# EAGLE schematic bmsf3 (EAGLE 4.13)
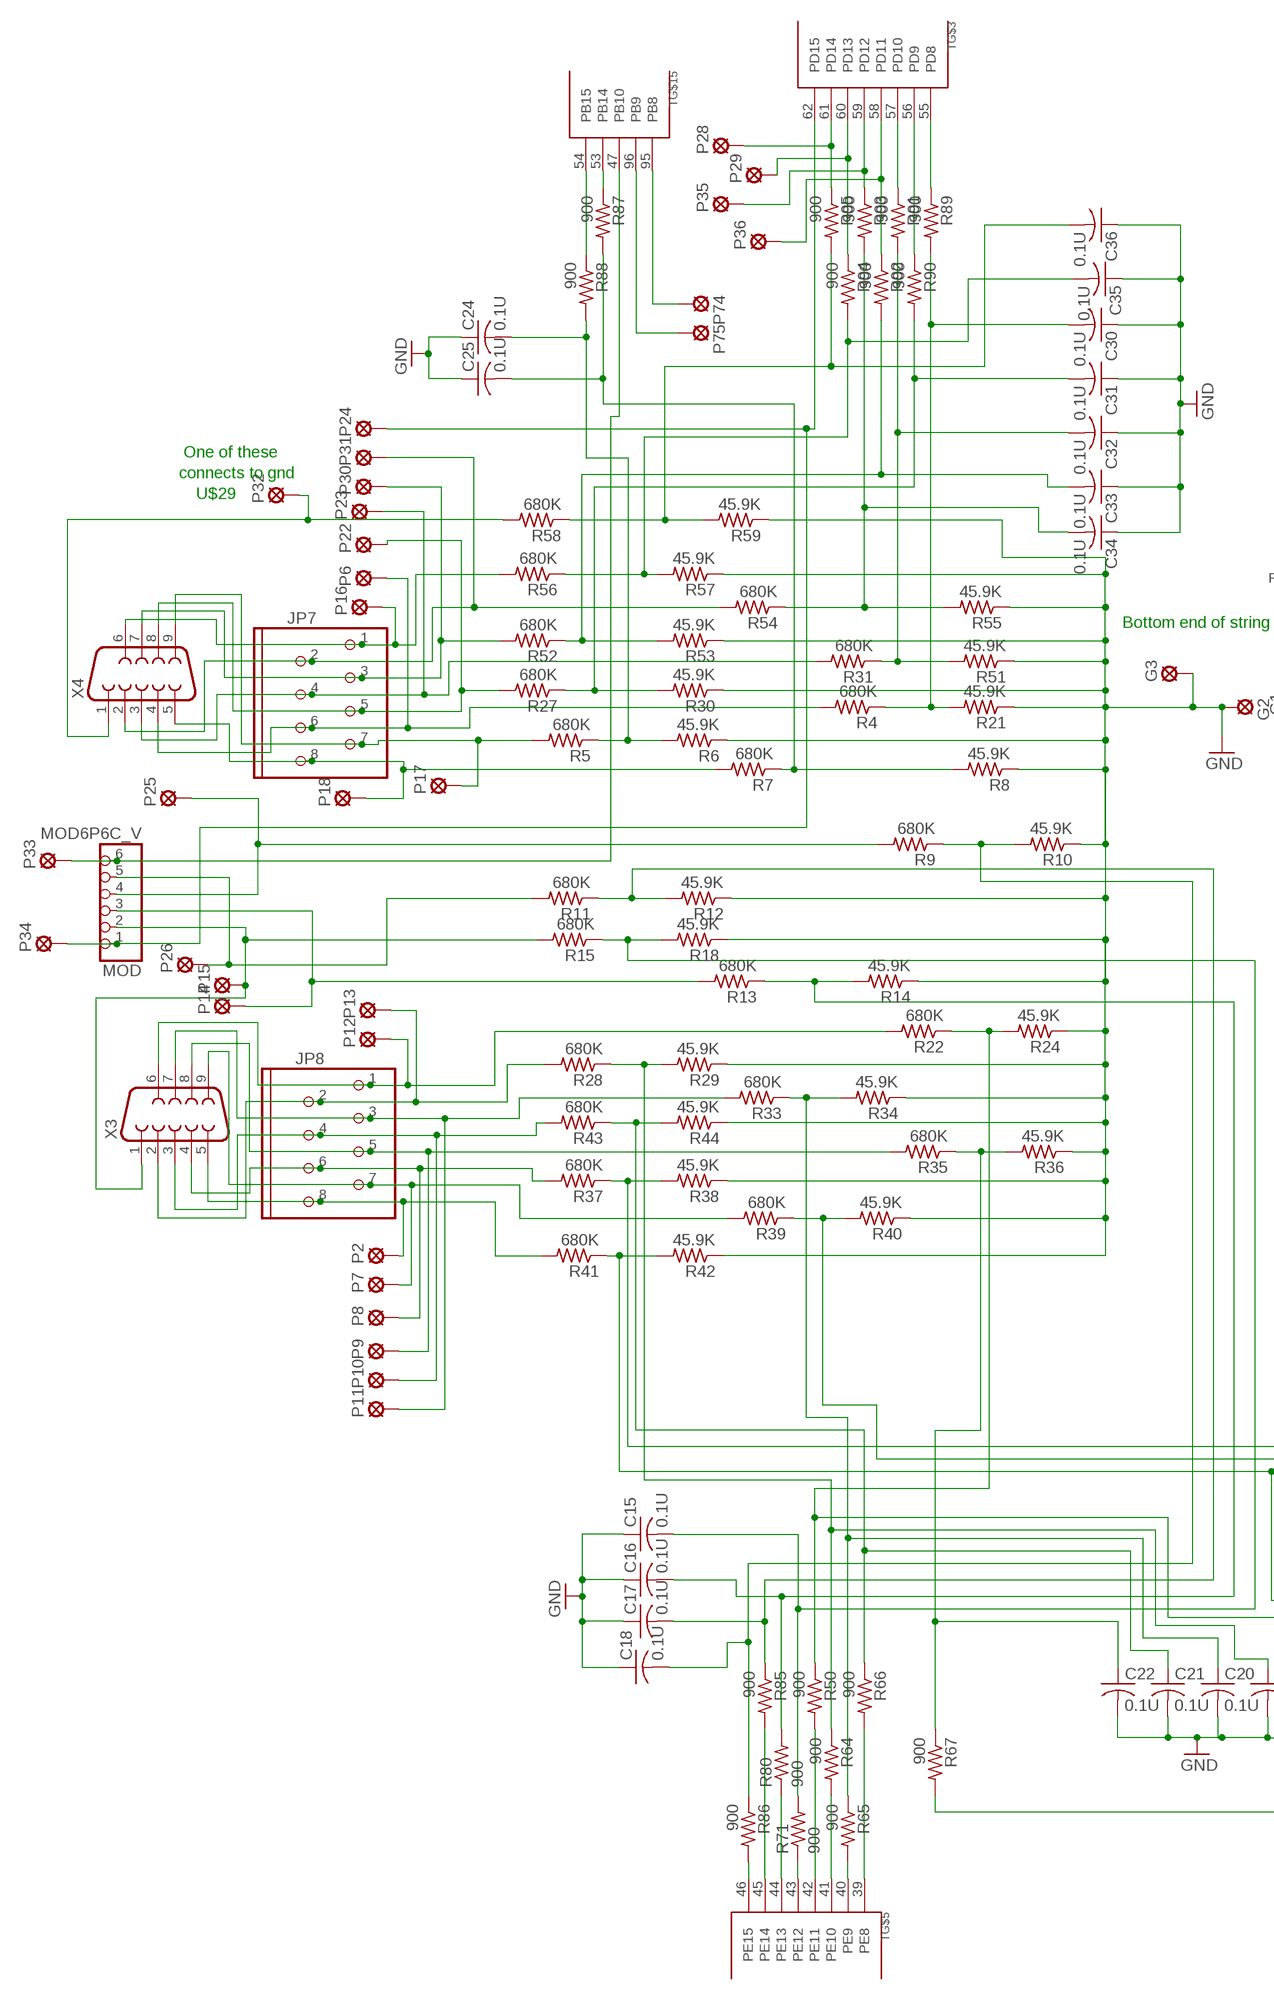
[diagram p0: schematic, sheet 1, part 1 of 2]
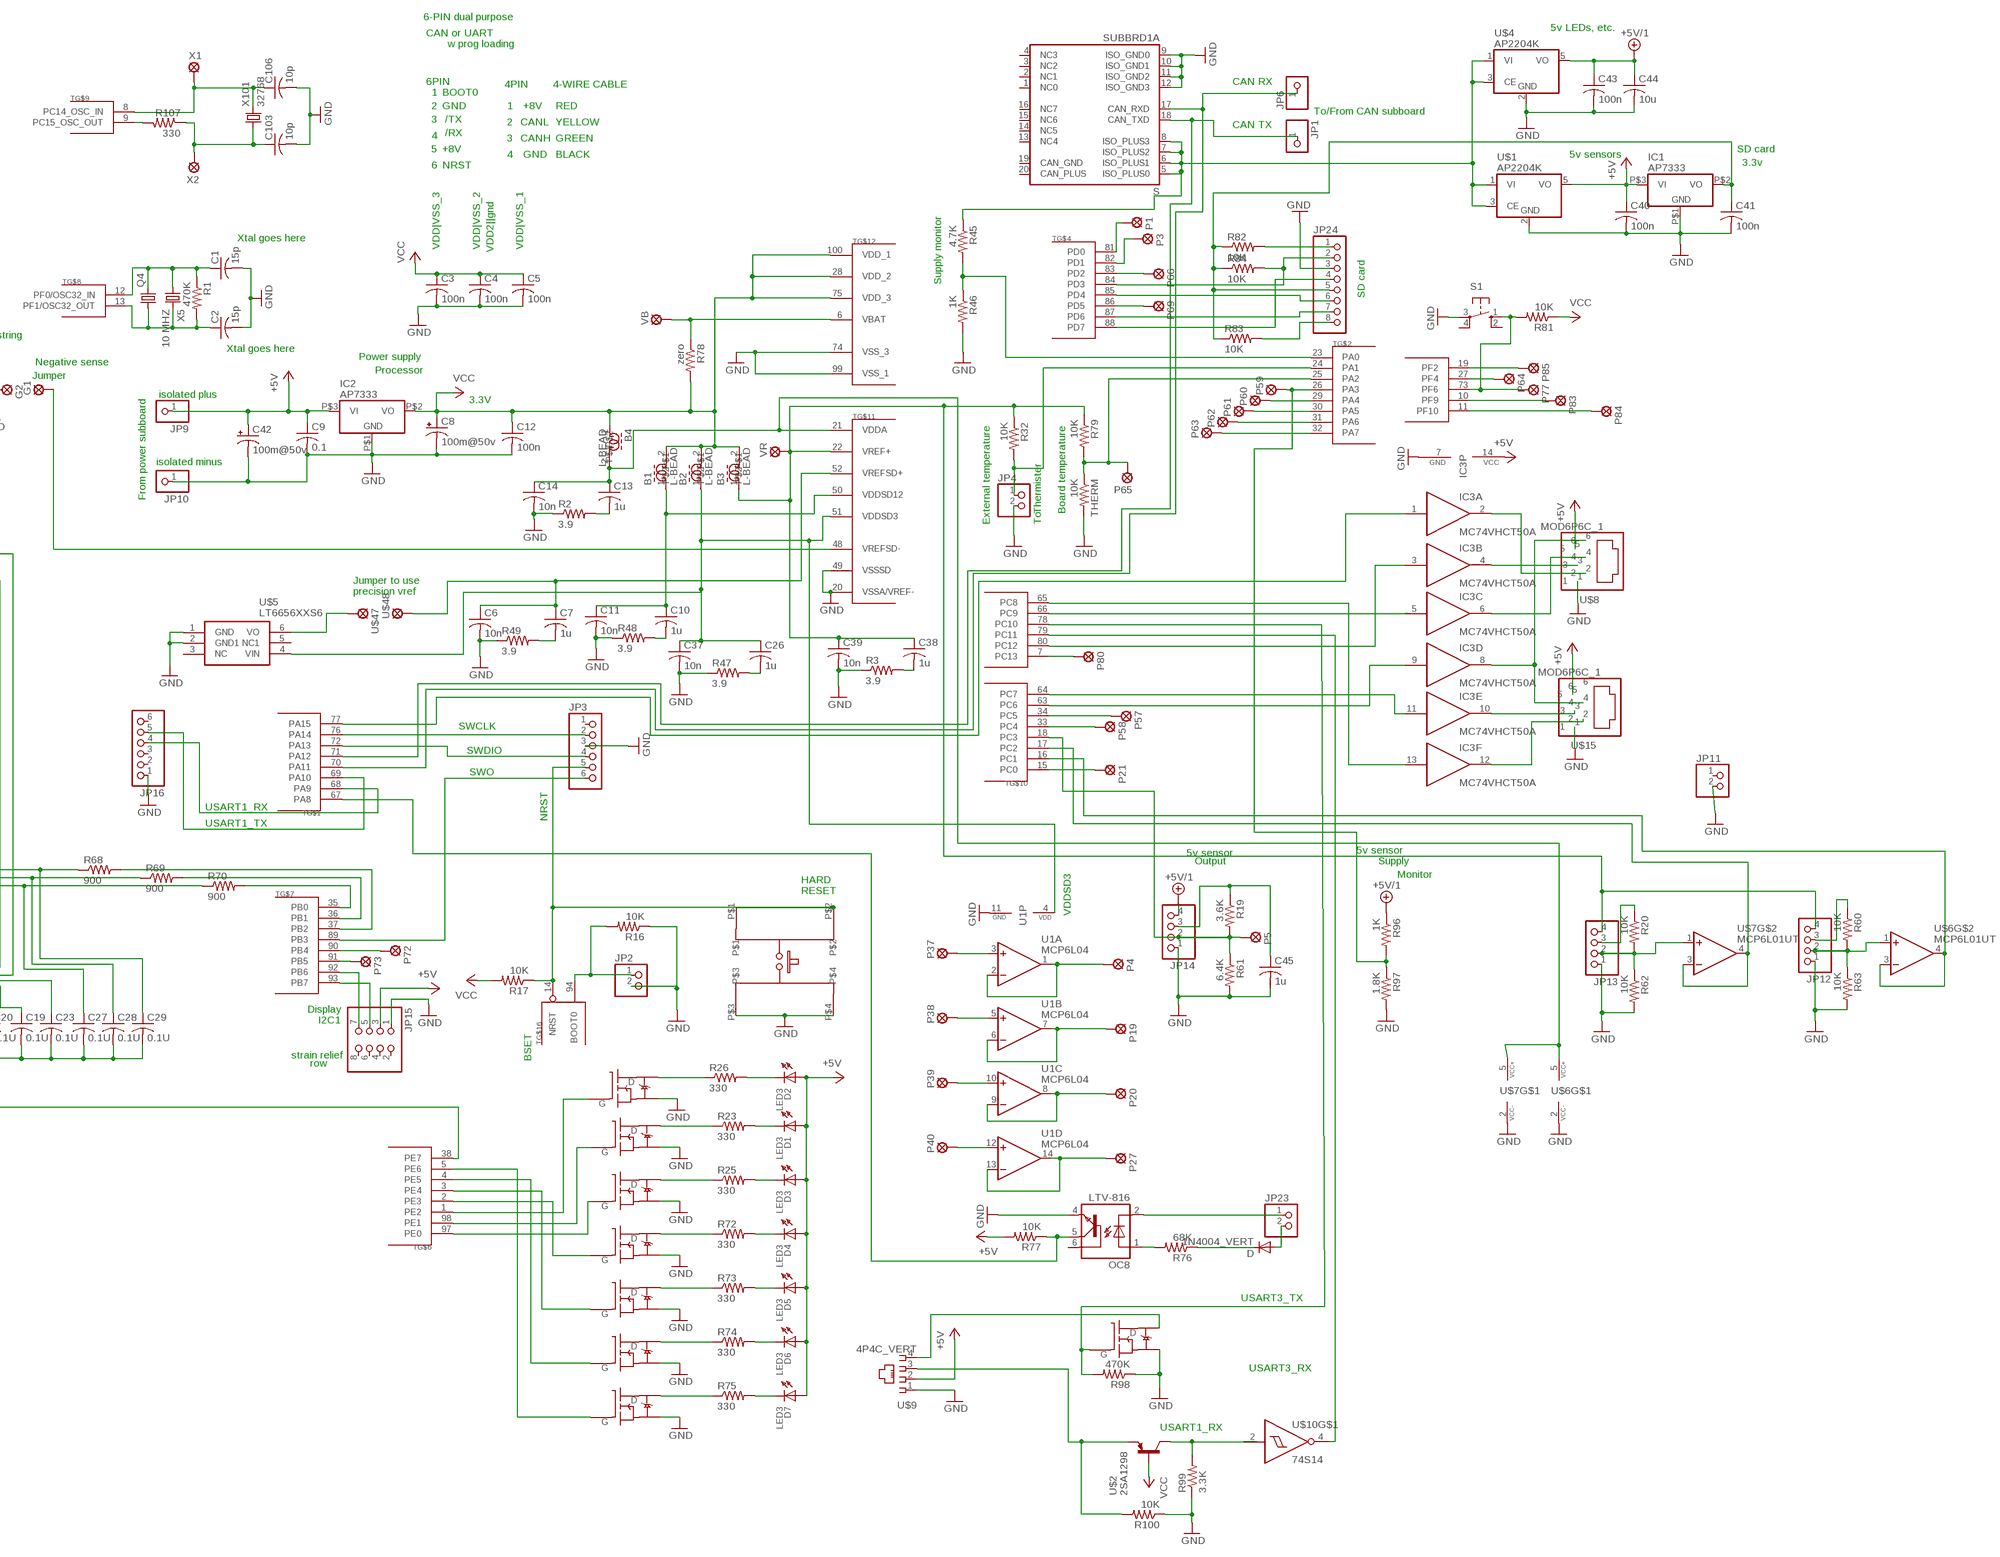
[diagram p1: schematic, sheet 1, part 2 of 2]

## Parts
B1  L-BEAD  [C0805]
B2  L-BEAD  [C0805]
B3  L-BEAD  [C0805]
B4  L-BEAD  [C0805]
C1  15p  C-USC0603  [C0603]
C2  15p  C-USC0603  [C0603]
C3  100n  C-USC0603  [C0603]
C4  100n  C-USC0603  [C0603]
C5  100n  C-USC0603  [C0603]
C6  10n  C-USC0603  [C0603]
C7  1u  C-USC0603  [C0603]
C8  100m@50v  CPOL-USE5-8.5  [E5-8,5]
C9  0.1  C-USC0603  [C0603]
C10  1u  C-USC0603  [C0603]
C11  10n  C-USC0603  [C0603]
C12  100n  C-USC0603  [C0603]
C13  1u  C-USC0603  [C0603]
C14  10n  C-USC0603  [C0603]
C15  0.1U  C-USC0603  [C0603]
C16  0.1U  C-USC0603  [C0603]
C17  0.1U  C-USC0603  [C0603]
C18  0.1U  C-USC0603  [C0603]
C19  0.1U  C-USC0603  [C0603]
C20  0.1U  C-USC0603  [C0603]
C21  0.1U  C-USC0603  [C0603]
C22  0.1U  C-USC0603  [C0603]
C23  0.1U  C-USC0603  [C0603]
C24  0.1U  C-USC0603  [C0603]
C25  0.1U  C-USC0603  [C0603]
C26  1u  C-USC0603  [C0603]
C27  0.1U  C-USC0603  [C0603]
C28  0.1U  C-USC0603  [C0603]
C29  0.1U  C-USC0603  [C0603]
C30  0.1U  C-USC0603  [C0603]
C31  0.1U  C-USC0603  [C0603]
C32  0.1U  C-USC0603  [C0603]
C33  0.1U  C-USC0603  [C0603]
C34  0.1U  C-USC0603  [C0603]
C35  0.1U  C-USC0603  [C0603]
C36  0.1U  C-USC0603  [C0603]
C37  10n  C-USC0603  [C0603]
C38  1u  C-USC0603  [C0603]
C39  10n  C-USC0603  [C0603]
C40  100n  C-USC0603  [C0603]
C41  100n  C-USC0603  [C0603]
C42  100m@50v  CPOL-USE5-8.5  [E5-8,5]
C43  100n  C-USC0603  [C0603]
C44  10u  C-USC0603  [C0603]
C45  1u  C-USC0603  [C0603]
C103  10p  C-USC0603  [C0603]
C106  10p  C-USC0603  [C0603]
D  1N4004_VERT  [DO41-10_VERT]
D1  LED3  [LED3]
D2  LED3  [LED3]
D3  LED3  [LED3]
D4  LED3  [LED3]
D5  LED3  [LED3]
D6  LED3  [LED3]
D7  LED3  [LED3]
G1  SOLDPAD028  [SOLPAD028]
G2  SOLDPAD028  [SOLPAD028]
G3  SOLDPAD028  [SOLPAD028]
IC1  AP7333  MCP1702  [SOT-23A]
IC2  AP7333  MCP1702  [SOT-23A]
IC3  MC74VHCT50A  7407  [TSSOP14]
JP1  PINHD-1X1  [1X01]
JP2  PINHD-1X2  [1X02]
JP3  PINHD-1X6  [1X06]
JP4  PINHD-1X2  [1X02]
JP6  PINHD-1X1  [1X01]
JP7  MOD8P8C  [MOD8P8C]
JP8  MOD8P8C  [MOD8P8C]
JP9  PINHD-1X1  [1X01]
JP10  PINHD-1X1  [1X01]
JP11  PINHD-1X2  [1X02]
JP12  PINHD-1X4  [1X04]
JP13  PINHD-1X4  [1X04]
JP14  PINHD-1X4  [1X04]
JP15  PINHD-2X4  [2X04]
JP16  PINHD-1X6  [1X06]
JP23  PINHD-1X2  [1X02]
JP24  PINHD-1X8  [1X08]
MOD  MOD6P6C_V  [MOD6P6C_VERT]
OC8  LTV-816  4N35  [DIL06]
P1  SOLDPAD028  [SOLPAD028]
P2  SOLDPAD028  [SOLPAD028]
P3  SOLDPAD028  [SOLPAD028]
P4  SOLDPAD028  [SOLPAD028]
P5  SOLDPAD028  [SOLPAD028]
P6  SOLDPAD028  [SOLPAD028]
P7  SOLDPAD028  [SOLPAD028]
P8  SOLDPAD028  [SOLPAD028]
P9  SOLDPAD028  [SOLPAD028]
P10  SOLDPAD028  [SOLPAD028]
P11  SOLDPAD028  [SOLPAD028]
P12  SOLDPAD028  [SOLPAD028]
P13  SOLDPAD028  [SOLPAD028]
P14  SOLDPAD028  [SOLPAD028]
P15  SOLDPAD028  [SOLPAD028]
P16  SOLDPAD028  [SOLPAD028]
P17  SOLDPAD028  [SOLPAD028]
P18  SOLDPAD028  [SOLPAD028]
P19  SOLDPAD028  [SOLPAD028]
P20  SOLDPAD028  [SOLPAD028]
P21  SOLDPAD028  [SOLPAD028]
P22  SOLDPAD028  [SOLPAD028]
P23  SOLDPAD028  [SOLPAD028]
P24  SOLDPAD028  [SOLPAD028]
P25  SOLDPAD028  [SOLPAD028]
P26  SOLDPAD028  [SOLPAD028]
P27  SOLDPAD028  [SOLPAD028]
P28  SOLDPAD028  [SOLPAD028]
P29  SOLDPAD028  [SOLPAD028]
P30  SOLDPAD028  [SOLPAD028]
P31  SOLDPAD028  [SOLPAD028]
P32  SOLDPAD028  [SOLPAD028]
P33  SOLDPAD028  [SOLPAD028]
P34  SOLDPAD028  [SOLPAD028]
P35  SOLDPAD028  [SOLPAD028]
P36  SOLDPAD028  [SOLPAD028]
P37  SOLDPAD028  [SOLPAD028]
P38  SOLDPAD028  [SOLPAD028]
P39  SOLDPAD028  [SOLPAD028]
P40  SOLDPAD028  [SOLPAD028]
P57  SOLDPAD028  [SOLPAD028]
P58  SOLDPAD028  [SOLPAD028]
P59  SOLDPAD028  [SOLPAD028]
P60  SOLDPAD028  [SOLPAD028]
P61  SOLDPAD028  [SOLPAD028]
P62  SOLDPAD028  [SOLPAD028]
P63  SOLDPAD028  [SOLPAD028]
P64  SOLDPAD028  [SOLPAD028]
P65  SOLDPAD028  [SOLPAD028]
P66  SOLDPAD028  [SOLPAD028]
P69  SOLDPAD028  [SOLPAD028]
P72  SOLDPAD028  [SOLPAD028]
P73  SOLDPAD028  [SOLPAD028]
P74  SOLDPAD028  [SOLPAD028]
P75  SOLDPAD028  [SOLPAD028]
P77  SOLDPAD028  [SOLPAD028]
P80  SOLDPAD028  [SOLPAD028]
P83  SOLDPAD028  [SOLPAD028]
P84  SOLDPAD028  [SOLPAD028]
P85  SOLDPAD028  [SOLPAD028]
Q1  IRLML2060  [SOT-23]
Q2  IRLML2060  [SOT-23]
Q3  IRLML2060  [SOT-23]
Q4  CRYTALHC49U-V  [HC49U-V]
Q6  IRLML2060  [SOT-23]
Q12  IRLML2060  [SOT-23]
Q13  IRLML2060  [SOT-23]
Q14  IRLML2060  [SOT-23]
Q15  IRLML2060  [SOT-23]
R1  470K  R-US_R0603  [R0603]
R2  3.9  R-US_R0603  [R0603]
R3  3.9  R-US_R0603  [R0603]
R4  680K  R-US_R0603  [R0603]
R5  680K  R-US_R0603  [R0603]
R6  45.9K  R-US_R0603  [R0603]
R7  680K  R-US_R0603  [R0603]
R8  45.9K  R-US_R0603  [R0603]
R9  680K  R-US_R0603  [R0603]
R10  45.9K  R-US_R0603  [R0603]
R11  680K  R-US_R0603  [R0603]
R12  45.9K  R-US_R0603  [R0603]
R13  680K  R-US_R0603  [R0603]
R14  45.9K  R-US_R0603  [R0603]
R15  680K  R-US_R0603  [R0603]
R16  10K  R-US_R0603  [R0603]
R17  10K  R-US_R0603  [R0603]
R18  45.9K  R-US_R0603  [R0603]
R19  3.6K  R-US_R0603  [R0603]
R20  10K  R-US_R0603  [R0603]
R21  45.9K  R-US_R0603  [R0603]
R22  680K  R-US_R0603  [R0603]
R23  330  R-US_R0603  [R0603]
R24  45.9K  R-US_R0603  [R0603]
R25  330  R-US_R0603  [R0603]
R26  330  R-US_R0603  [R0603]
R27  680K  R-US_R0603  [R0603]
R28  680K  R-US_R0603  [R0603]
R29  45.9K  R-US_R0603  [R0603]
R30  45.9K  R-US_R0603  [R0603]
R31  680K  R-US_R0603  [R0603]
R32  10K  R-US_R0603  [R0603]
R33  680K  R-US_R0603  [R0603]
R34  45.9K  R-US_R0603  [R0603]
R35  680K  R-US_R0603  [R0603]
R36  45.9K  R-US_R0603  [R0603]
R37  680K  R-US_R0603  [R0603]
R38  45.9K  R-US_R0603  [R0603]
R39  680K  R-US_R0603  [R0603]
R40  45.9K  R-US_R0603  [R0603]
R41  680K  R-US_R0603  [R0603]
R42  45.9K  R-US_R0603  [R0603]
R43  680K  R-US_R0603  [R0603]
R44  45.9K  R-US_R0603  [R0603]
R45  4.7K  R-US_R0603  [R0603]
R46  1K  R-US_R0603  [R0603]
R47  3.9  R-US_R0603  [R0603]
R48  3.9  R-US_R0603  [R0603]
R49  3.9  R-US_R0603  [R0603]
R50  900  R-US_R0603  [R0603]
R51  45.9K  R-US_R0603  [R0603]
R52  680K  R-US_R0603  [R0603]
R53  45.9K  R-US_R0603  [R0603]
R54  680K  R-US_R0603  [R0603]
R55  45.9K  R-US_R0603  [R0603]
R56  680K  R-US_R0603  [R0603]
R57  45.9K  R-US_R0603  [R0603]
R58  680K  R-US_R0603  [R0603]
R59  45.9K  R-US_R0603  [R0603]
R60  10K  R-US_R0603  [R0603]
R61  6.4K  R-US_R0603  [R0603]
R62  10K  R-US_R0603  [R0603]
R63  10K  R-US_R0603  [R0603]
R64  900  R-US_R0603  [R0603]
R65  900  R-US_R0603  [R0603]
R66  900  R-US_R0603  [R0603]
R67  900  R-US_R0603  [R0603]
R68  900  R-US_R0603  [R0603]
R69  900  R-US_R0603  [R0603]
R70  900  R-US_R0603  [R0603]
R71  900  R-US_R0603  [R0603]
R72  330  R-US_R0603  [R0603]
R73  330  R-US_R0603  [R0603]
R74  330  R-US_R0603  [R0603]
R75  330  R-US_R0603  [R0603]
R76  68K  R-US_R0603  [R0603]
R77  10K  R-US_R0603  [R0603]
R78  zero  R-US_R0603  [R0603]
R79  10K  R-US_R0603  [R0603]
R80  900  R-US_R0603  [R0603]
R81  10K  R-US_R0603  [R0603]
R82  10K  R-US_R0603  [R0603]
R83  10K  R-US_R0603  [R0603]
R84  10K  R-US_R0603  [R0603]
R85  900  R-US_R0603  [R0603]
R86  900  R-US_R0603  [R0603]
R87  900  R-US_R0603  [R0603]
R88  900  R-US_R0603  [R0603]
R89  900  R-US_R0603  [R0603]
R90  900  R-US_R0603  [R0603]
R91  900  R-US_R0603  [R0603]
R92  900  R-US_R0603  [R0603]
R93  900  R-US_R0603  [R0603]
R94  900  R-US_R0603  [R0603]
R95  900  R-US_R0603  [R0603]
R96  1K  R-US_R0603  [R0603]
R97  1.8K  R-US_R0603  [R0603]
R98  470K  R-US_R0603  [R0603]
R99  3.3K  R-US_R0603  [R0603]
R100  10K  R-US_R0603  [R0603]
R107  330  R-US_M0805  [M0805]
S  SUBBRD1A  [SUBBRD1B]
S1  10-XX  [B3F-10XX]
SW1  E-SWITCH  [E-SWITCH]
T  STM32F373VXT6  [TQFP100_NARROW]
THERM  10K  R-US_R0603  [R0603]
U1  MCP6L04  TLC084T  [TSSOP14]
U$1  AP2204K  [SOT-25]
U$2  2SA1298  [SOT23]
U$4  AP2204K  [SOT-25]
U$5  LT6656XXS6  [SOT23-6]
U$6  MCP6L01UT  [SOT23-5]
U$7  MCP6L01UT  [SOT23-5]
U$8  MOD6P6C_1  [MOD6P6C_1]
U$9  4P4C_VERT  [MOD4P4C_VERT]
U$10  74S14  [SOT-23]
U$15  MOD6P6C_1  [MOD6P6C_1]
U$47  SOLDPAD028  [SOLPAD028]
U$48  SOLDPAD028  [SOLPAD028]
VB  SOLDPAD028  [SOLPAD028]
VR  SOLDPAD028  [SOLPAD028]
X1  SOLDPAD028  [SOLPAD028]
X2  SOLDPAD028  [SOLPAD028]
X3  F09H  [F09H]
X4  F09HP  [F09HP]
X5  10 MHZ  CRYTALHC49UP  [HC49UP]
X101  32768  CRYTAL  [TC26H_SMD]

## Nets
3.3V+SD_POWER: C41.1 IC1.P$2(VO) JP24.5 R82.1 R83.1 R84.1
4WIRE_RCV: R100.2 U$2.2(E) U$9.3
4WIRE_XMIT: Q6.3(D) U$9.4
+5V: C9.1 C40.1 C42.+ D1.A D2.A D3.A D4.A D5.A D6.A D7.A IC1.P$3(VI) IC2.P$3(VI) IC3.14(P:VCC) JP9.1 JP15.3 R77.2 U$1.5(VO) U$8.5 U$9.2 U$15.5
+5V/1: C43.1 C44.1 JP14.4 R96.1 U$4.5(VO)
+7V: R45.1 S.5(ISO_PLUS0) S.6(ISO_PLUS1) S.7(ISO_PLUS2) S.8(ISO_PLUS3) U$1.1(VI) U$1.3(CE) U$4.1(VI) U$4.3(CE)
BOOT0: JP2.1 R16.2 T.94(BOOT0)
GND: C1.2 C2.2 C3.2 C4.2 C5.2 C6.2 C8.- C9.2 C11.2 C12.2 C14.2 C15.1 C16.1 C17.1 C18.1 C19.2 C20.2 C21.2 C22.2 C23.2 C24.1 C25.1 C27.2 C28.2 C29.2 C30.1 C31.1 C32.1 C33.1 C34.1 C35.1 C36.1 C37.2 C39.2 C40.2 C41.2 C42.- C43.2 C44.2 C45.2 C103.2 C106.2 G2.MP G3.MP IC1.P$1(GND) IC2.P$1(GND) IC3.7(P:GND) JP2.2 JP3.3 JP4.2 JP10.1 JP11.2 JP12.1 JP13.1 JP14.1 JP15.1 JP16.1 JP24.3 OC8.4(EMI) Q1.2(S) Q2.2(S) Q3.2(S) Q6.2(S) Q12.2(S) Q13.2(S) Q14.2(S) Q15.2(S) R2.1 R3.1 R6.1 R8.1 R10.1 R12.1 R14.1 R16.1 R18.1 R21.1 R24.1 R29.1 R30.1 R34.1 R36.1 R38.1 R40.1 R42.1 R44.1 R46.2 R47.1 R48.1 R49.1 R51.1 R53.1 R55.1 R57.1 R59.1 R61.2 R62.2 R63.2 R97.2 R98.1 R99.1 R100.1 S1.3(P) S.9(ISO_GND0) S.10(ISO_GND1) S.11(ISO_GND2) S.12(ISO_GND3) SW1.P$3 SW1.P$4 T.20(VSSA/VREF-) T.49(VSSSD) T.74(VSS_3) T.99(VSS_1) THERM.2 U1.11(P:GND) U$1.2(GND) U$4.2(GND) U$5.1(GND) U$5.2(GND1) U$6.2(VCC-) U$7.2(VCC-) U$8.1 U$9.1 U$15.1
LT6656_VO: U$5.6(VO) U$47.MP
N$1: C45.1 JP14.3 R19.1
N$2: D.C R76.1
N$9: P19.MP U1.6(B:-IN) U1.7(B:OUT)
N$10: P27.MP U1.13(D:-IN) U1.14(D:OUT)
N$11: P4.MP U1.1(A:OUT) U1.2(A:-IN)
N$12: JP13.2 R20.2 R62.1 U$7.1(+IN)
N$13: JP12.2 R60.2 R63.1 U$6.1(+IN)
N$16: P20.MP U1.8(C:OUT) U1.9(C:-IN)
N$18: P37.MP U1.3(A:+IN)
N$19: P38.MP U1.5(B:+IN)
N$20: P39.MP U1.10(C:+IN)
N$21: P40.MP U1.12(D:+IN)
N$39: R107.2 T.9(PC15_OSC_OUT)
N$44: OC8.1(A) R76.2
N$46: JP23.1 OC8.2(C)
N$47: D.A JP23.2
N$61: JP13.3 R20.1
N$62: JP12.3 R60.1
NRST: JP3.5 R17.1 SW1.P$1 SW1.P$2 T.14(NRST)
P77: P83.MP T.10(PF9)
PA0|SUPPLY_MONITOR|ADC_0|COMP1_INM: R45.2 R46.1 T.23(PA0)
PA1|THERMISTOR|ADC_1|CPM1_INP: JP4.1 R32.2 T.24(PA1)
PA2|THERMISTOR|ADC_2|COMP2_INM: P65.MP R79.2 T.25(PA2) THERM.1
PA3|ADC_3|COMP2_INP: P59.MP R96.2 R97.1 T.26(PA3)
PA4|SPI1_NSS|SD_CS|ADC_4: P60.MP T.29(PA4)
PA5|SPI1_CK|SD_CLK|ADC_5: P61.MP T.30(PA5)
PA6|SPI1_MISO|SD_DO|ADC_6: P62.MP T.31(PA6)
PA7|SPI1_MOSI|SD_DI|ADC_7: P63.MP T.32(PA7)
PA8: OC8.5(COL) R77.1 T.67(PA8)
PA9_USART1_TX: JP16.5 T.69(PA10)
PA10_USART1_RX: JP16.4 T.68(PA9)
PA11_CANRX: JP6.1 S.17(CAN_RXD) T.70(PA11)
PA12_CANTX: JP1.1 S.18(CAN_TXD) T.71(PA12)
PA13_SWDIO: JP3.4 T.72(PA13)
PA14_SWCLK: JP3.2 T.76(PA14)
PA15: IC3.1(A:I) T.77(PA15)
PA15_BUFF: IC3.2(A:O) U$8.2
PB0: R70.2 T.35(PB0)
PB0|SD1_6P|ADC_8: C27.1 R41.1 R42.2 R70.1
PB1: R69.2 T.36(PB1)
PB1|SD1_5P|SD1_6M|ADC_9: C28.1 R39.1 R40.2 R69.1
PB2: R68.2 T.37(PB2)
PB2|SD1_4P|SD2_6P: C29.1 R37.1 R38.2 R68.1
PB3_SWO: JP3.6 T.89(PB3)
PB4: P72.MP T.90(PB4)
PB5: P73.MP T.91(PB5)
PB6|I2C1_SCL: JP15.7 T.92(PB6)
PB7|I2C1_SDA: JP15.5 T.93(PB7)
PB8: P74.MP T.95(PB8)
PB9: P75.MP T.96(PB9)
PB10|SD2_0P: MOD.6 P33.MP T.47(PB10)
PB14: R87.1 T.53(PB14)
PB15: R88.1 T.54(PB15)
PB15_PWRLED: D2.K R26.2
PB15_PWRLED_D: Q3.3(D) R26.1
PC0: P21.MP T.15(PC0)
PC1|ADC11: T.16(PC1) U$6.3(-IN) U$6.4(OUT)
PC2|ADC12: T.17(PC2) U$7.3(-IN) U$7.4(OUT)
PC3|ADC13: JP14.2 P5.MP R19.2 R61.1 T.18(PC3)
PC4: P58.MP T.33(PC4)
PC4_LED1: D1.K R23.2
PC4_LED_D: Q1.3(D) R23.1
PC5: P57.MP T.34(PC5)
PC5_LED1: D4.K R72.2
PC5_LED2: D3.K R25.2
PC5_LED3: D5.K R73.2
PC5_LED4: D6.K R74.2
PC5_LED5: D7.K R75.2
PC5_LED_D: Q2.3(D) R25.1
PC5_LED_D1: Q12.3(D) R72.1
PC5_LED_D2: Q13.3(D) R73.1
PC5_LED_D3: Q14.3(D) R74.1
PC5_LED_D4: Q15.3(D) R75.1
PC6: IC3.9(D:I) T.63(PC6)
PC6_BUFF: IC3.8(D:O) U$8.6 U$15.4
PC7: IC3.11(E:I) T.64(PC7)
PC7_BUFF: IC3.10(E:O) U$15.3
PC8: IC3.13(F:I) T.65(PC8)
PC8_BUFF: IC3.12(F:O) U$15.2
PC9: IC3.5(C:I) T.66(PC9)
PC9_BUFF: IC3.6(C:O) U$8.4
PC10_USART3_TX: Q6.1(G) R98.2 T.78(PC10)
PC11_USART3_RX: T.79(PC11) U$10.4(O)
PC12: IC3.3(B:I) T.80(PC12)
PC12_BUFF: IC3.4(B:O) U$8.3
PC13: P80.MP T.7(PC13)
PC14_OSC32IN|XTAL: C103.1 R107.1 X2.MP X101.P$1
PC14_OSC_IN: C106.1 T.8(PC14_OSC_IN) X1.MP X101.P$2
PD0: P1.MP T.81(PD0)
PD0_OSC_IN_XTAL: C1.1 Q4.2 R1.1 T.12(PF0/OSC32_IN) X5.1
PD1: P3.MP T.82(PD1)
PD1_OSC_OUT_XTAL: C2.1 Q4.1 R1.2 T.13(PF1/OSC32_OUT) X5.2
PD2: P66.MP T.83(PD2)
PD3|SPI2_MISO: JP24.2 R84.2 T.84(PD3)
PD4|SPI2_MOSI: JP24.6 T.85(PD4)
PD5|USART2_TX: P69.MP T.86(PD5)
PD6|SPI2_NSS: JP24.7 T.87(PD6)
PD7|SPI2_SCK: JP24.4 T.88(PD7)
PD8: R89.1 T.55(PD8)
PD8|SD3_6P: C30.2 R4.1 R21.2 R89.2
PD9: R90.1 T.56(PD9)
PD9|SD3_5P|SD3_6M: C31.2 R27.1 R30.2 R90.2
PD10: R91.1 T.57(PD10)
PD10|SD3_4P: C32.2 R31.1 R51.2 R91.2
PD11: P36.MP R92.1 T.58(PD11)
PD11|SD3_3P|SD3_4M: C33.2 R52.1 R53.2 R92.2
PD12: P35.MP R93.1 T.59(PD12)
PD12|SD3_2P: C34.2 R54.1 R55.2 R93.2
PD13: P29.MP R94.1 T.60(PD13)
PD13|SD_1P|SD3_2M: C35.2 R56.1 R57.2 R94.2
PD14: P28.MP R95.1 T.61(PD14)
PD14|SD30P: C36.2 R58.1 R59.2 R95.2
PD15|SD3_0M: MOD.1 P24.MP P34.MP T.62(PD15)
PE0: Q2.1(G) T.97(PE0)
PE1: Q1.1(G) T.98(PE1)
PE2: Q3.1(G) T.1(PE2)
PE3: Q12.1(G) T.2(PE3)
PE4: Q13.1(G) T.3(PE4)
PE5: Q14.1(G) T.4(PE5)
PE6: Q15.1(G) T.5(PE6)
PE7: R67.2 T.38(PE7)
PE7|SD1_3P|SD1_4M|SD2_5P|SD2_6M: C22.1 R35.1 R36.2 R67.1
PE7|SD13P,14M|SD25P,26M: JP8.5 P9.MP R35.2 X3.8
PE8: R66.2 T.39(PE8)
PE8|SD1_8P|SD2_8P: C21.1 R43.1 R44.2 R66.1
PE9: R65.2 T.40(PE9)
PE9|SD1_7P|SD1_8M|SD2_7P|SD2_8M: C20.1 R33.1 R34.2 R65.1
PE10: R64.2 T.41(PE10)
PE10|SD1_2P: C19.1 R28.1 R29.2 R64.1
PE11: R50.2 T.42(PE11)
PE11|SD1_1P|SD1_2M|SD2_4P: C23.1 R22.1 R24.2 R50.1
PE12: R71.1 T.43(PE12)
PE12|SD1_0P|SD2_3P|SD2_4M: C15.2 R15.1 R18.2 R71.2
PE13: R80.1 T.44(PE13)
PE13|SD1_0M|SD2_2P: C16.2 R13.1 R14.2 R80.2
PE14: R85.2 T.45(PE14)
PE14|SD2_1P|SD2_2M: C17.2 R11.1 R12.2 R85.1
PE15: R86.2 T.46(PE15)
PE15|SD2_0P: C18.2 R9.1 R10.2 R86.1
PF2: P85.MP T.19(PF2)
PF4: P64.MP T.27(PF4)
PF6: P77.MP R81.2 S1.1(S) T.73(PF6)
PF10: P84.MP T.11(PF10)
RX_INVERTED: R99.2 U$2.3(C) U$10.2(I)
SD3_7P|SD3_8M: C24.2 R5.1 R6.2 R88.2
SD3_8P: C25.2 R7.1 R8.2 R87.2
SD_DAT1: JP24.1 R82.2
SD_DAT2: JP24.8 R83.2
VBAT: R78.1 T.6(VBAT) VB.MP
VCC: B1.2 B2.2 B3.2 B4.1 C3.1 C4.1 C5.1 C8.+ C12.1 IC2.P$2(VO) R17.2 R78.2 R81.1 T.28(VDD_2) T.75(VDD_3) T.100(VDD_1) U$2.1(B)
VDDA: B4.2 C13.1 C14.1 T.21(VDDA) U$6.5(VCC+) U$7.5(VCC+)
VDDA_DAMP: C13.2 R2.2
VDDSD3: B2.1 C26.1 C37.1 T.51(VDDSD3) U1.4(P:VDD) U$5.4(VIN)
VDDSD3_DAMP: C26.2 R47.2
VDDSD12_DAMP: C10.2 R48.2
VDDSE12: B1.1 C10.1 C11.1 T.50(VDDSD12)
VREF+: B3.1 C38.1 C39.1 JP12.4 JP13.4 R32.1 R79.1 T.22(VREF+) VR.MP
VREF_DAMP: C38.2 R3.2
VREFSD+: C6.1 C7.1 T.52(VREFSD+) U$48.MP
VREFSD-: G1.MP T.48(VREFSD-)
VREFSD_DAMP: C7.2 R49.2
X_PB0|SD1_6P|ADC_8: JP8.8 P2.MP R41.2 X3.5
X_PB1|SD1_5P|SD1_6M|ADC_9: JP8.7 P7.MP R39.2 X3.9
X_PB2|SD1_4P|SD2_6P: JP8.6 P8.MP R37.2 X3.4
X_PB14|SD3_8P: JP7.8 P18.MP R7.2 X4.5
X_PB15|SD3_7P|SD3_8M: JP7.7 P17.MP R5.2 X4.9
X_PD8|SD3_6P: JP7.6 P6.MP R4.2 X4.4
X_PD9|SD3_5P|SD3_6M: JP7.5 P22.MP R27.2 X4.8
X_PD10|SD3_4P: JP7.4 P23.MP R31.2 X4.3
X_PD11|SD3_3P|SD3_4M: JP7.3 P30.MP R52.2 X4.7
X_PD12|SD3_2P: JP7.2 P31.MP R54.2 X4.2
X_PD13|SD_1P|SD3_2M: JP7.1 P16.MP R56.2 X4.6
X_PD14|SD30P: P32.MP R58.2 X4.1
X_PE8|SD1_8P|SD2_8P: JP8.4 P10.MP R43.2 X3.3
X_PE9|SD1_7P|SD1_8M|SD2_7P|SD2_8M: JP8.3 P11.MP R33.2 X3.7
X_PE10|SD1_2P: JP8.2 P13.MP R28.2 X3.2
X_PE11|SD1_1P|SD1_2M|SD2_4P: JP8.1 P12.MP R22.2 X3.6
X_PE12|SD1_0P|SD2_3P|SD2_4M: MOD.2 P15.MP R15.2 X3.1
X_PE13|SD1_0M|SD2_2P: MOD.3 P14.MP R13.2
X_PE14|SD2_1P|SD2_2M: MOD.5 P26.MP R11.2
X_PE15|SD2_0P: MOD.4 P25.MP R9.2
Unconnected: JP3.1 JP11.1 JP15.2 JP15.4 JP15.6 JP15.8 JP16.2 JP16.3 JP16.6 OC8.6(BAS) S1.2(S1) S1.4(P1) S.1(NC0) S.2(NC1) S.3(NC2) S.4(NC3) S.13(NC4) S.14(NC5) S.15(NC6) S.16(NC7) S.19(CAN_GND) S.20(CAN_PLUS) U$5.3(NC) U$5.5(NC1) U$15.6

## Notes on the sheet
- 6-PIN dual purpose
- 5v LEDs, etc.
- CAN or UART
- w prog loading
- 6PIN | 4PIN | 4-WIRE CABLE | CAN RX
- 1 | BOOT0
- 2 | GND | 1 | +8V | RED
- To/From CAN subboard
- 3 | /TX | 2 | CANL | YELLOW
- CAN TX
- 4 | /RX
- 3 | CANH | GREEN
- 5 | +8V | SD card
- 4 | GND | BLACK | 5v sensors
- 6 | NRST | 3.3v
- One of these
- connects to gnd | Xtal goes here
- VDD|VSS_3 | VDD|VSS_2 | VDD2||gnd | VDD|VSS_1
- U$29
- Supply monitor
- SD card
- Bottom end of string
- Xtal goes here
- Power supply
- Negative sense
- Processor
- Jumper
- isolated plus
- 3.3V
- isolated minus
- From power subboard
- Thermister | Board temperature
- External temperature | To
- Jumper to use
- precision vref
- SWCLK
- SWDIO
- SWO
- USART1_RX
- NRST
- USART1_TX
- 5v sensor | 5v sensor
- Output | Supply
- Monitor
- HARD
- RESET
- VDDSD3
- Display
- I2C1
- strain relief | BSET
- row
- USART3_TX
- USART3_RX
- USART1_RX

## Power pins joined to a net without a drawn wire
GND: U$10.3(GND)
VCC: U$10.5(VCC)

## Library data of the parts
B1-B4 = rcl:L-BEAD
C1-C7 C9-C41 C43-C45 C103 C106 = rcl:C-US: CAPACITOR, American symbol
C8 C42 = rcl:CPOL-US: POLARIZED CAPACITOR, American symbol
D = diode:1N4004_VERT
D1-D7 = led:LED3
G1-G3 P1-P40 P57-P66 P69 P72-P75 P77 P80 P83-P85 U$47 U$48 VB VR X1 X2 = solpad:SOLDPAD028
IC1 IC2 = linear:MCP1702
IC3 = 74xx-us:74*07: Hex BUFFER, open collector high-voltage output
JP1 JP6 JP9 JP10 = pinhead:PINHD-1X1: PIN HEADER
JP2 JP4 JP11 JP23 = pinhead:PINHD-1X2: PIN HEADER
JP3 JP16 = pinhead:PINHD-1X6: PIN HEADER
JP7 JP8 = DEH:MOD8P8C
JP12-JP14 = pinhead:PINHD-1X4: PIN HEADER
JP15 = pinhead:PINHD-2X4: PIN HEADER
JP24 = pinhead:PINHD-1X8: PIN HEADER
MOD = DEH:MOD6P6C_V
OC8 = optocoupler:4N35: MOTOROLA OPTO COUPLER
Q1-Q3 Q6 Q12-Q15 = transistor-fet:IRLML2060
Q4 X5 X101 = crystal:CRYTAL: CRYSTAL
R1-R100 R107 THERM = rcl:R-US_: RESISTOR, American symbol
S = dc-dc-converter:SUBBRD1A
S1 = switch-omron:10-XX: OMRON SWITCH
SW1 = switch-misc:E-SWITCH
T = stm32:STM32F373VXT6
U1 = op-amp:TLC084: BiMOS OP-AMP Single Supply
U$1 U$4 = linear:AP2204K
U$2 = transistor-pnp:2SA1298
U$5 = v-reg-2:LT6656XXS6
U$6 U$7 = op-amp:MCP6L01UT
U$8 U$15 = DEH:MOD6P6C_1
U$9 = DEH:4P4C_VERT
U$10 = 74xx-us:74S14
X3 X4 = con-subd:F09: SUB-D